# Altium schematic sheet [1] - Schematic Blocks.SchDoc
size A4; SheetNumber: 1; SheetTotal: 1
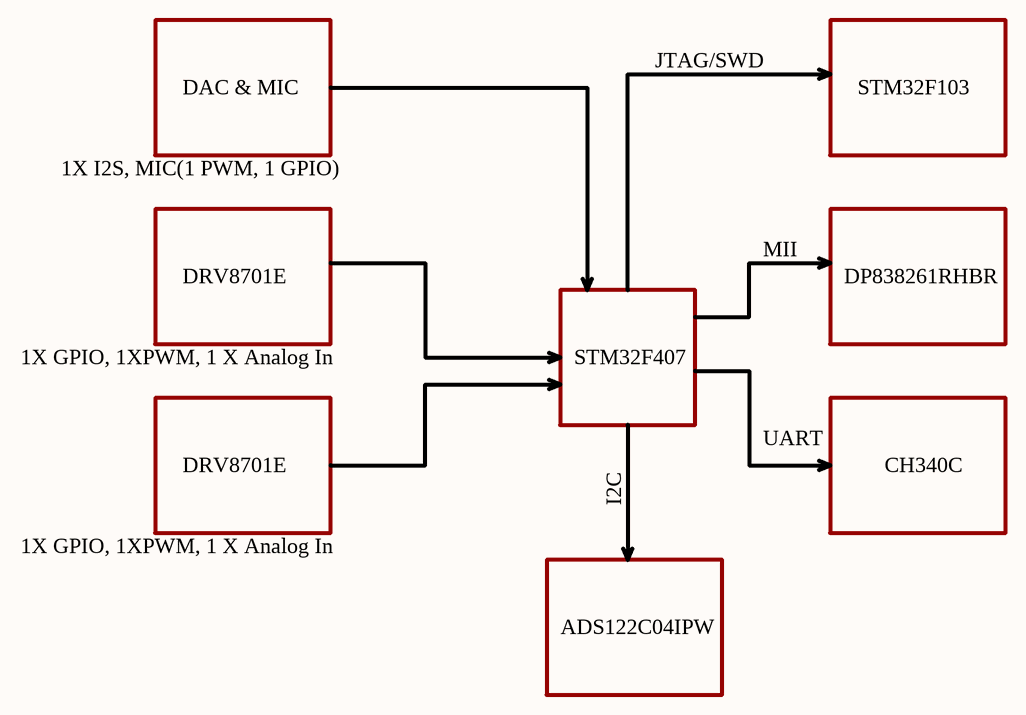
[diagram p0: [1] - Schematic Blocks.SchDoc]

## Notes on the sheet
- DAC & MIC
- JTAG/SWD
- STM32F103
- 1X I2S, MIC(1 PWM, 1 GPIO)
- DRV8701E
- MII
- DP838261RHBR
- 1X GPIO, 1XPWM, 1 X Analog In
- STM32F407
- I2C
- UART
- CH340C
- ADS122C04IPW